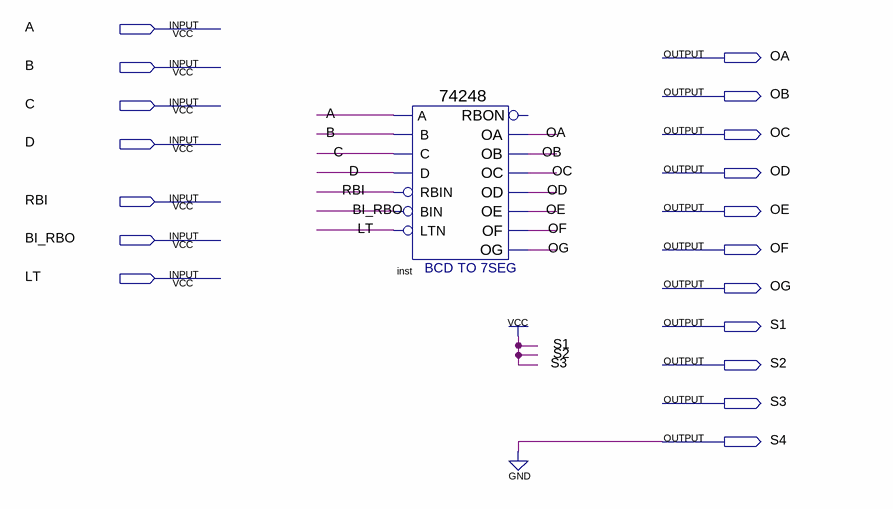
[diagram p0: schematic sheet]
// Quartus schematic BCD_seven_seg_seven_four_two_four_eight.bdf as structural Verilog: 1 symbols, 18 pins
module BCD_seven_seg_seven_four_two_four_eight (
  input  A,
  input  B,
  input  C,
  input  D,
  input  RBI,
  input  BI_RBO,
  input  LT,
  output OA,
  output OB,
  output OC,
  output OD,
  output OE,
  output OF,
  output OG,
  output S1,
  output S2,
  output S3,
  output S4
);

  \74248  inst (
    .A(A), .B(B), .RBIN(RBI), .D(D), .C(C), .LTN(LT), .BIN(BI_RBO), .OG(OG), .OD(OD), .OE(OE), .OF(OF),
    .OA(OA), .OB(OB), .OC(OC));  // open: RBON

  assign S1 = 1'b1;
  assign S2 = 1'b1;
  assign S3 = 1'b1;
  assign S4 = 1'b0;
endmodule
